# Altium schematic sheet MaUWB.SchDoc
size A4; SheetNumber: 3; SheetTotal: 4
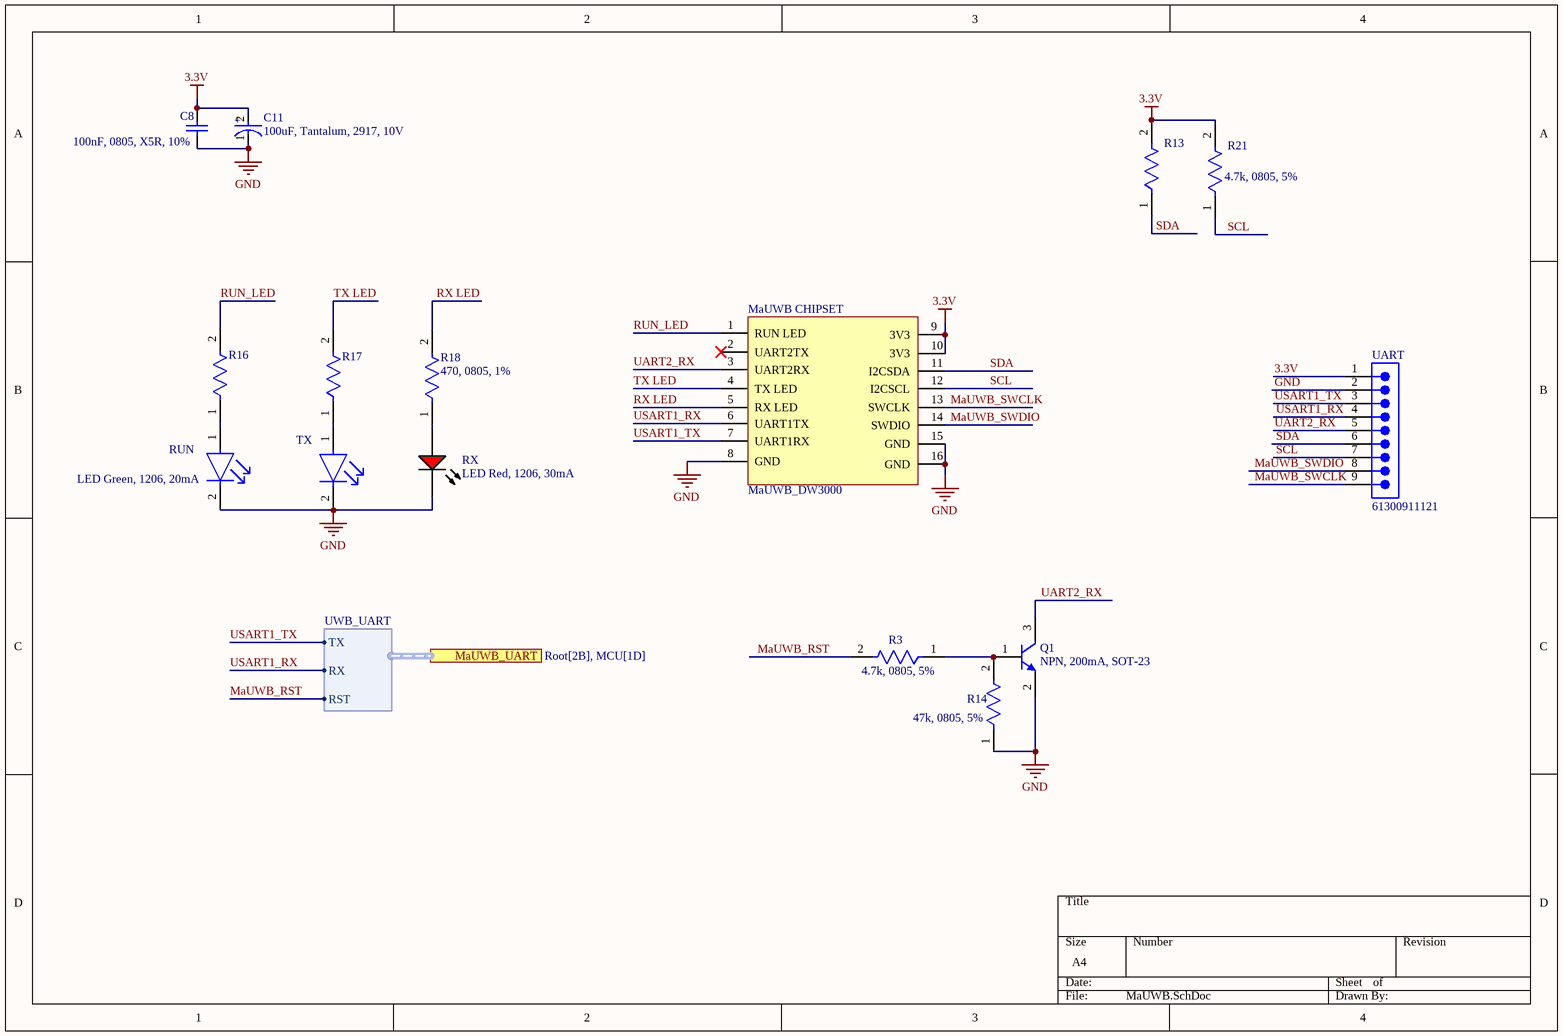
[diagram p0: MaUWB.SchDoc]

## Parts
C8  100nF, 0805, X5R, 10%  [CAPC2013X140X50ML20T25]
C11  100uF, Tantalum, 2917, 10V  [FP-TAJD-MFG]
MaUWB_CHIPSET  MaUWB_DW3000  [MaUWB_DW3000]
Q1  NPN, 200mA, SOT-23  [ONSC-SOT-23-3-318-08_V]
R3  4.7k, 0805, 5%  [FP-RMCF0805-MFG]
R13  (no value)  [FP-RMCF0805-MFG]
R14  47k, 0805, 5%  [FP-CRGCQ0805-IPC_C]
R16  (no value)  [FP-RMCF0805-IPC_C]
R17  (no value)  [FP-RMCF0805-IPC_C]
R18  470, 0805, 1%  [FP-RMCF0805-IPC_C]
R21  4.7k, 0805, 5%  [FP-RMCF0805-MFG]
RUN  LED Green, 1206, 20mA  [FP-SML-LX1206GC-TR-MFG]
RX  LED Red, 1206, 30mA  [LUMX-SML-LX1206IC_V]
TX  (no value)  [FP-SML-LX1206GC-TR-MFG]
UART  61300911121  [61300911121]

## Ports
MaUWB_UART (harness UWB_UART, see Root[2B], MCU[1D])

## Harnesses
UWB_UART: TX, RX, RST

## Nets
3.3V: C8.2 C11.2(A) MaUWB_CHIPSET.9(3V3) MaUWB_CHIPSET.10(3V3) R13.2 R21.2 UART.1
GND: C8.1 C11.1(C) MaUWB_CHIPSET.8(GND) MaUWB_CHIPSET.15(GND) MaUWB_CHIPSET.16(GND) Q1.2(E) R14.1 RUN.2(C) RX.2(K) TX.2(C) UART.2
MaUWB_RST: R3.2 ; port MaUWB_UART.RST
MaUWB_SWCLK: MaUWB_CHIPSET.13(SWCLK) UART.9
MaUWB_SWDIO: MaUWB_CHIPSET.14(SWDIO) UART.8
RUN_LED: MaUWB_CHIPSET.1(RUN_LED) R16.2
RX LED: MaUWB_CHIPSET.5(RX_LED) R18.2
SCL: MaUWB_CHIPSET.12(I2CSCL) R21.1 UART.7
SDA: MaUWB_CHIPSET.11(I2CSDA) R13.1 UART.6
TX LED: MaUWB_CHIPSET.4(TX_LED) R17.2
UART2_RX: MaUWB_CHIPSET.3(UART2RX) Q1.3(C) UART.5
USART1_RX: MaUWB_CHIPSET.6(UART1TX) UART.4 ; port MaUWB_UART.RX
USART1_TX: MaUWB_CHIPSET.7(UART1RX) UART.3 ; port MaUWB_UART.TX
NetQ1_1: Q1.1(B) R3.1 R14.2
NetR16_1: R16.1 RUN.1(A)
NetR17_1: R17.1 TX.1(A)
NetR18_1: R18.1 RX.1(A)

Not connected (* = marked no-connect by the designer): MaUWB_CHIPSET 2(UART2TX)*

## Notes on the sheet
- (in symbol CMP-04424-000500-1) +

## Library data of the parts
C8 = CMP-2007-04689-1: Part Number: 08055D104KAT2A; Manufacturer: AVX Interconnect / Elco
C11 = CMP-04424-000500-1: 100uF 10V  ±10% 900mΩ 2917  SMD Tantalum Capacitor; Polarity: Polar; Q Factor: 6; Leakage Current: 10uA; Dissipation Factor: 6%; ESR (Equivalent Series Resistance): 700mR; Tolerance: 10%; Series: TAJ; Case Code (Metric): 7343; Case Code (Imperial): 2917; Termination: SMD/SMT; Max Operating Temperature: 125°C; REACH SVHC: No SVHC; Voltage: 10V; Dielectric Material: Tantalum; Voltage Rating (DC): 10V; Lead Free: Lead Free; Voltage Rating: 10V; Height - Seated (Max): 0.122inch; Width: 4.3mm; Depth: 4.3mm; Construction: Flat; Case/Package: 2917; Features: General Purpose; Capacitance: 100uF; Packaging: Tape and Reel; Package Quantity: 1; Height: 2.9mm; Length: 7.3mm; Radiation Hardening: No; RoHS Compliant: Yes; Min Operating Temperature: -55°C; Mount: Surface Mount
Q1 = CMP-1048-00631-1: General Purpose Transistor, NPN Silicon, 3-Pin SOT-23, Pb-Free, Tape and Reel; Manufacturer: On Semiconductor; PartNumber: MMBT3904LT1G; IC Continuous (A): 0.2; fT Min (MHz): 300; ComponentLink2Description: Datasheet; Polarity: NPN; PackageDescription: 3-Pin Small Outline Transistor, Body 2.92 x 1.3 mm, Pitch 0.95 mm; ComponentLink2URL: http://www.onsemi.cn/pub_link/Collateral/MMBT3904LT1-D.PDF; DatasheetVersion: Rev. 12; Mounting Technology: Surface Mount; ComponentLink1URL: http://www.onsemi.com/; ComponentLink3Description: Package Specification; ComponentLink1Description: Manufacturer URL; PackageVersion: Rev. AP, 11/2009; PackageReference: SOT-23-3-318-08; Packing: Tape and Reel; ComponentLink3URL: http://www.onsemi.cn/pub_link/Collateral/318-08.PDF; RoHS: TRUE
R3 R13 R21 = CMP-26527-004085-1: 4.7kΩ ±5% 0.125W 0805 Thick Film Chip Resistor AEC-Q200 compliant; Temperature Coefficient: 200ppm/°C; Max Power Dissipation: 125mW; Resistance: 4.7kR; RoHS Compliant: Yes; Package Quantity: 10000; Packaging: Tape and Reel; Contact Plating: Tin; Radiation Hardening: No; Mount: Surface Mount; Height: 0.026inch; Case Code (Metric): 2012; Tolerance: 5%; Case/Package: 0805; Width: 0.049inch; Series: RMCF; Case Code (Imperial): 0805; Number of Terminations: 2; Min Operating Temperature: -55°C; Resistor Type: Thick Film; Max Operating Temperature: 155°C; Length: 0.079inch; Features: Automotive AEC-Q200
R14 = CMP-03211-001080-1: CRGCQ0805 47KΩ 0.125W ±100ppm/°C 5% 150V; Manufacturer: TE Connectivity; Manufacturer Part Number: CRGCQ0805J47K; Tolerance: 0.05; Resistance: 47KΩ; ComponentLink2Description: Datasheet; Category: Res; Automotive Grade: Grade 1066; RoHS: TRUE; Device Class L1: Passive Components; Lead Free: Yes; Automotive: Yes; Temperature Coefficient: ±100ppm/°C; Series: CRGCQ; Device Class L3: Chip SMD Resistors; Temperature: -55°C to +155°C; Octopart: https://octopart.com/crgcq0805j47k-te+connectivity-91018230; ComponentLink2URL: https://www.te.com/commerce/DocumentDelivery/DDEController?Action=showdoc&DocId=Data+Sheet%7F1773204-3%7F1%7Fpdf%7FEnglish%7FENG_DS_1773204-3_1.pdf%7F4-2176341-1075; Temperature Range High: +155°C; Ipc Land Pattern Name: RESC200125X55; Voltage Rating: 150V; Ambient Temperature Range High: +70°C; Device Class L2: Resistors; Temperature Range Low: -55°C; Value: 47KΩ; Power Rating: 0.125W; Height: 0.65mm; Package: CRGCQ0805; Composition: Thick Film
R16-R18 = CMP-26527-003746-1: 470Ω ±1% 0.125W 0805 Thick Film Chip Resistor AEC-Q200 compliant; Resistance: 470R; Temperature Coefficient: 100ppm/°C; Max Power Dissipation: 125mW; Resistor Type: Thick Film; Number of Terminations: 2; Packaging: Tape and Reel; RoHS Compliant: Yes; Case/Package: 0805; Mount: Surface Mount; Contact Plating: Tin; Series: RMCF; Min Operating Temperature: -55°C; Radiation Hardening: No; Features: Automotive AEC-Q200; Tolerance: 1%; Max Operating Temperature: 155°C
RUN = CMP-2000-07122-2: LED GREEN CLEAR 1206 SMD; Luminous Intensity: 10mcd; Forward Voltage: 2.2V; Viewing Angle: 160°; Lens Color: Colorless; Approvals: UL; Dominant Wavelength: 565nm; Current Rating: 25mA; Number of LEDs: 1; Power Rating: 65mW; Lens Style: Rectangular; Test Current: 20mA; Length: 3.2mm; Mount: Surface Mount; Package Quantity: 1; Forward Current: 20mA; Case/Package: 1206; Lead Free: Lead Free; Case Code (Imperial): 1206; Max Operating Temperature: 85°C; REACH SVHC: No SVHC; RoHS Compliant: Yes; Number of Pins: 2; Illumination Color: Green; Width: 1.6mm; Packaging: Tape and Reel; Wavelength: 565nm; Lens Transparency: Clear; Height: 1.1mm; Color: Green; Min Operating Temperature: -40°C; Case Code (Metric): 3216
RX = CMP-2000-07123-1: LED Red, 65 mW, -40 to 85 degC, 2-Pin SMD, RoHS, Tape and Reel; Manufacturer: Lumex; Part No: SML-LX1206IC-TR; LED Material: GaAsP; Peak Wavelength: 635nm; Number of LEDs: 1; Viewing Angle: 160; Reverse Voltage: 5(Min)V; Lens Appearance: ColorlessNonDiffused; Intensity: 6mcd; Pin_Count: 2; Lens Dimensions: 2x1.6x0.5mm; Mounting: SurfaceMount; ECCN: EAR99; RoHS: Unknown; Package Description: 2-Pin Surface Mount Device, Body 3.2 x 1.5 mm; Mounting Technology: SurfaceMount; Dominant Wavelength: N/A; Supplier_Package: SMD; Supplier Standard Pack: 3,000; Color: Red; Dimension: 3.2x1.6x1.1mm; HTS: 8541402000; Family: SML-LX1206IC; Supplier: Lumex; Datasheet URL: http://www.lumex.com/content/files/ProductAttachment/SML-LX1206IC-TR.pdf; Package Reference: SML-LX1206IC; Manufacturer URL: http://www.lumexinstruments.com/; Type: Uni-Color; Operating Temperature: -25to85C; Packaging: TapeandReel; Datasheet Version: Rev. J, 08/2012
TX = CMP-2000-07122-2: LED GREEN CLEAR 1206 SMD; Test Current: 20mA; Luminous Intensity: 10mcd; Forward Voltage: 2.2V; Viewing Angle: 160°; Lens Color: Colorless; Approvals: UL; Dominant Wavelength: 565nm; Current Rating: 25mA; Number of LEDs: 1; Power Rating: 65mW; Lens Style: Rectangular; Length: 3.2mm; Mount: Surface Mount; Package Quantity: 1; Forward Current: 20mA; Case/Package: 1206; Lead Free: Lead Free; Case Code (Imperial): 1206; Max Operating Temperature: 85°C; REACH SVHC: No SVHC; RoHS Compliant: Yes; Number of Pins: 2; Illumination Color: Green; Width: 1.6mm; Packaging: Tape and Reel; Wavelength: 565nm; Lens Transparency: Clear; Height: 1.1mm; Color: Green; Min Operating Temperature: -40°C; Case Code (Metric): 3216
UART = CMP-1502-01080-4: THT Vertical Pin Header WR-PHD, Pitch 2.54 mm, Single Row, 9 pins; Pitch: 2.54mm; Connector Type: Male Pin; Current Rating: 3A; Number of Positions: 9; Operating Supply Voltage: 250V; Gender: Male; Contact Resistance: 20mΩ; Color: Black; Packaging: Bulk; Number of Pins: 9; Contact Plating: Gold; Contact Material: Copper; RoHS: Compliant; Contact Mating Length: 5.9944mm; Termination: Solder; Lead Pitch: 2.54mm; Orientation: Vertical; Number of Contacts: 9; Number of Rows: 1; Mount: Through Hole